# EAGLE design main (EAGLE 9.0.0)
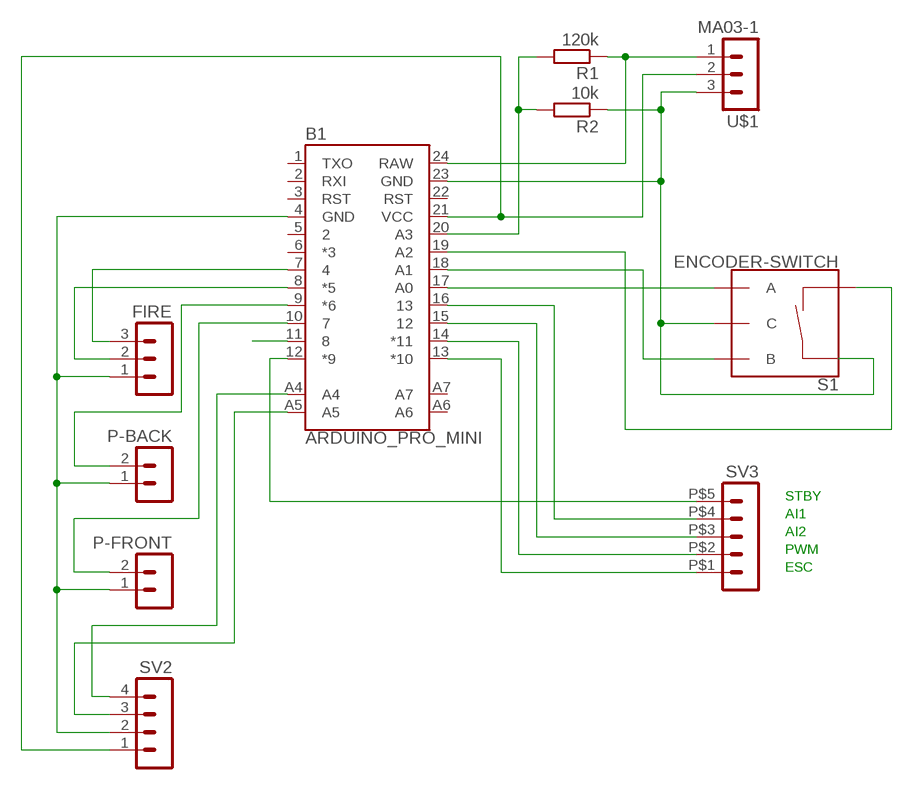
[diagram p0: schematic, sheet 1]

## Parts
B1  ARDUINO_PRO_MINI  [ARDUINO_PRO_MINI_WO]
FIRE  MA03-1  [MA03-1]
P-BACK  MA02-1  [MA02-1]
P-FRONT  MA02-1  [MA02-1]
R1  120k  R-EU_0204/5  [0204/5]
R2  10k  R-EU_0204/2V  [0204V]
S1  ENCODER-SWITCH  [ROTARY_ENC_PLAIN]
SV2  MA04-1  [MA04-1]
SV3  MA05-1  [MA05-1]
U$1  MA03-1  [MA03-1]

## Nets
N$1: B1.24(RAW) R1.1 U$1.1
N$2: B1.12(*9) SV3.P$5
N$3: B1.7 FIRE.3
N$4: B1.4(GND) FIRE.1 P-BACK.1 P-FRONT.1 SV2.2
N$5: B1.8(*5) FIRE.2
N$6: B1.11
N$7: B1.18(A1) S1.B
N$8: B1.9(*6) P-BACK.2
N$9: B1.10 P-FRONT.2
N$10: B1.17(A0) S1.A
N$11: B1.19(A2) S1.SW-
N$12: B1.23(GND) R2.1 S1.C U$1.3
N$13: B1.20(A3) R1.2 R2.2
N$15: B1.A4 SV2.4
N$16: B1.A5 SV2.3
N$17: B1.16 SV3.P$4
N$18: B1.15 SV3.P$3
N$19: B1.14(*11) SV3.P$2
N$20: B1.13(*10) SV3.P$1
N$23: B1.21(VCC) SV2.1 U$1.2
Unconnected: B1.1(TXO) B1.2(RXI) B1.3(RST) B1.5 B1.6(*3) B1.22(RST) B1.A6 B1.A7 S1.SW+

## Notes on the sheet
- STBY
- AI1
- AI2
- PWM
- ESC

## Library data of the parts
B1 = SparkFun-Boards:ARDUINO_PRO_MINI: SparkFun Pro Mini Pro Mini compatible footprint. Dimensions: 0.7 x 1.3" PCB Thickness: 0.8mm SparkFun Products: 3.3V/8MHz <https://www.sparkfun.com/products/11114> 5V/16MHz <https://www.sparkfun.com/products/11113>
FIRE U$1 = con-lstb:MA03-1
P-BACK P-FRONT = con-lstb:MA02-1
R1 R2 = rcl:R-EU_: RESISTOR, European symbol
S1 = SparkFun-Switches:ENCODER-SWITCH: Rotary Encoder w/ Select Switch Encoders rotate similarly to potentiometers, but they’re different from potentiometers in that an encoder has full rotation without limits. They output gray code so that you can tell how much and in which direction the encoder has been turned. This encoder includes a push-down select switch built into the shaft. SparkFun Products Rotary Encoder <https://www.sparkfun.com/products/9117> (COM-09117); SF_SKU: COM-09117
SV2 = con-lstb:MA04-1: PIN HEADER; OC_FARNELL: unknown; OC_NEWARK: unknown
SV3 = con-lstb:MA05-1: PIN HEADER; OC_FARNELL: unknown; OC_NEWARK: unknown

## Net classes
0 default: clearance 0.205 mm

## Board
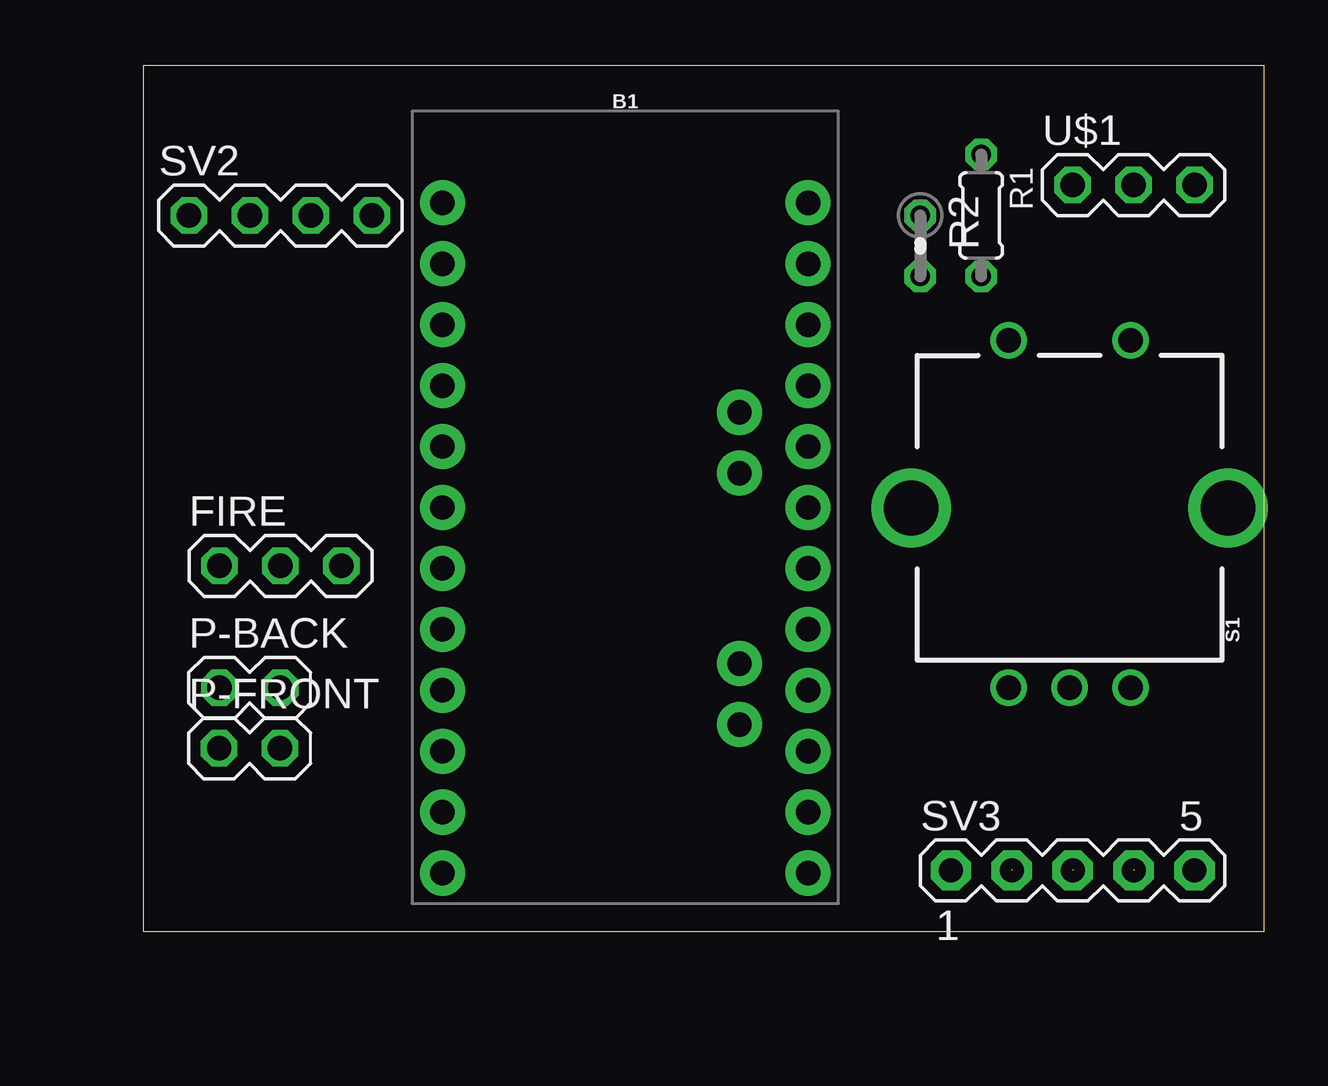
[diagram p1: board, top side]
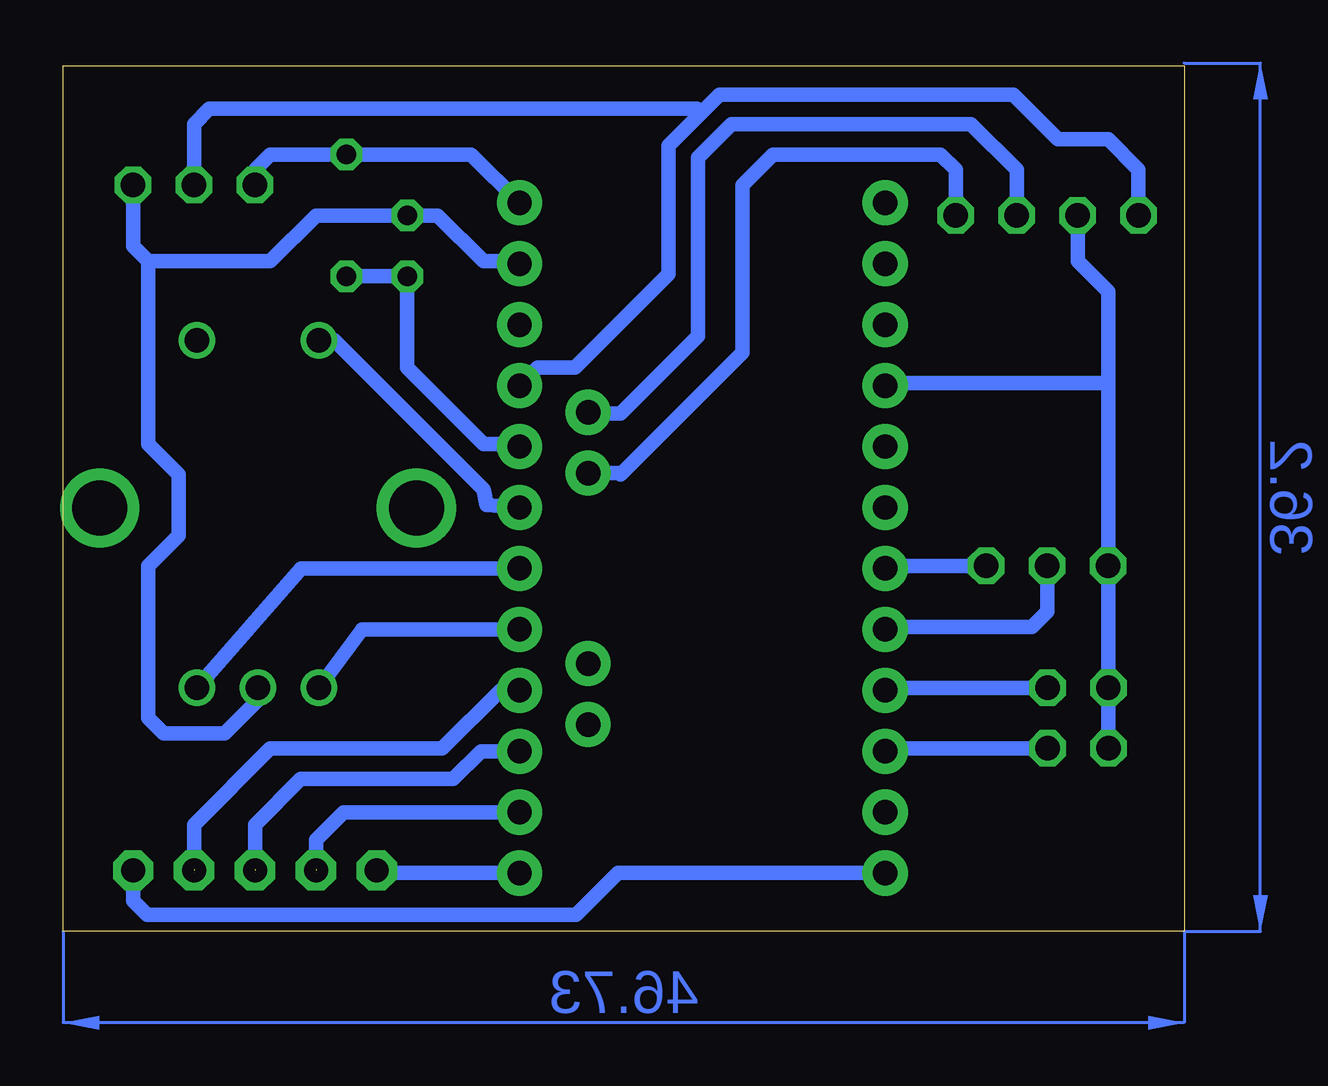
[diagram p2: board, bottom side, seen from below]

Size 46.73 x 36.09 mm. Coordinates in mm from the lower left corner, seen from the top.
Outline: 0,0 46.73,0 46.73,36.09 0,36.09 0,0
Copper layers (1*16): Top 0.035mm / dielectric 1.5mm / Bottom 0.035mm
Design rules "default *": minimum track width 6mil, minimum drill 0.35mm, track to track 24mil, track to pad 12mil, pad to pad 6mil, via to via 6mil, smd to smd 6mil, copper to edge 40mil, drill to drill 6mil, minimum pad ring 10mil, minimum via ring 8mil, stop-mask expansion 4mil, vias tented up to drill 0mil, thermal gap 10mil

### Footprints (pad centres in the part's own frame; a part is rotated, then mirrored left to right if it is on the bottom)
ARDUINO_PRO_MINI_WO = drill 1.016 pad 1.88: 1 -7.62,12.7; 2 -7.62,10.16; 3 -7.62,7.62; 4 -7.62,5.08; 5 -7.62,2.54; 6 -7.62,0; 7 -7.62,-2.54; 8 -7.62,-5.08; 9 -7.62,-7.62; 10 -7.62,-10.16; 11 -7.62,-12.7; 12 -7.62,-15.24; 13 7.62,-15.24; 14 7.62,-12.7; 15 7.62,-10.16; 16 7.62,-7.62; 17 7.62,-5.08; 18 7.62,-2.54; 19 7.62,0; 20 7.62,2.54; 21 7.62,5.08; 22 7.62,7.62; 23 7.62,10.16; 24 7.62,12.7; A4 4.763,1.429; A5 4.763,3.969; A6 4.763,-9.049; A7 4.763,-6.509
MA03-1 = drill 1.016 octagon: 1 -2.54,0; 2 0,0; 3 2.54,0
MA02-1 = drill 1.016 octagon: 1 0,0; 2 2.54,0
0204/5 = drill 0.813 octagon: 1 -2.54,0; 2 2.54,0
0204V = drill 0.813 octagon: 1 -1.27,0; 2 1.27,0
ROTARY_ENC_PLAIN = drill 1.016: A 7.493,-2.54; B 7.493,2.54; C 7.493,0; SW+ -6.985,2.54; SW- -6.985,-2.54 | drill 2.286: P$3 0,6.604; P$4 0,-6.604
MA04-1 = drill 1.016 octagon: 1 -3.81,0; 2 -1.27,0; 3 1.27,0; 4 3.81,0
MA05-1 = drill 1 pad 1.676 octagon: P$1 -5.08,0; P$2 -2.54,0; P$3 0,0; P$4 2.54,0; P$5 5.08,0

### Placement (x,y rotation side)
B1  20.09,17.67 0 top
FIRE  5.71,15.24 0 top
P-BACK  3.16,10.16 0 top
P-FRONT  3.16,7.63 0 top
R1  34.92,29.84 270 top
R2  32.38,28.57 270 top
S1  38.61,17.65 270 top
SV2  5.71,29.84 0 top
SV3  38.73,2.54 0 top
U$1  41.27,31.11 0 top

### Tracks (layer width: path | path; a pad name or v marks a point on that pad's centre or on a via)
N$1
  Bottom 0.61: B1.24 29.72,32.38 R1.1 38.1,32.38 38.73,31.75 U$1.1
N$2
  Bottom 0.61: B1.12 23.61,2.43 25.35,0.69 43.23,0.69 43.81,1.27 SV3.P$5
N$3
  Bottom 0.61: B1.7 12.36,15.24 FIRE.3
N$4
  Bottom 0.61: B1.4 12.36,22.86 3.17,22.86 | 3.17,22.86 3.17,17.15 | FIRE.1 3.17,17.15 | 3.17,17.15 P-BACK.1 3.16,13.98 P-FRONT.1 | SV2.2 4.45,27.94 3.17,26.67 3.17,22.86
N$5
  Bottom 0.61: B1.8 12.36,12.7 6.35,12.7 5.71,13.34 FIRE.2
N$7
  Bottom 0.61: S1.B 36.81,15.13 B1.18
N$8
  Bottom 0.61: B1.9 12.36,10.15 P-BACK.2
N$9
  Bottom 0.61: B1.10 12.35,7.63 P-FRONT.2
N$10
  Bottom 0.61: S1.A 34.27,12.59 B1.17
N$11
  Bottom 0.61: B1.19 29.09,17.78 29.21,18.41 35.43,24.64 S1.SW-
N$12
  Bottom 0.61: B1.23 27.82,27.94 29.21,27.94 31.11,29.84 R2.1 36.2,29.84 38.1,27.94 43.18,27.94 | 43.18,27.94 43.81,28.57 U$1.3 | 43.18,27.94 43.18,20.32 41.91,19.05 41.91,16.51 43.18,15.24 43.18,8.89 42.55,8.26 40.01,8.26 38.61,9.65 S1.C
N$13
  Bottom 0.61: B1.20 27.82,20.32 29.21,20.32 32.38,23.5 R2.2 R1.2
N$15
  Bottom 0.61: B1.A4 23.54,19.1 23.5,19.05 18.41,24.13 18.41,31.11 17.14,32.38 10.16,32.38 9.53,31.75 SV2.4
N$16
  Bottom 0.61: B1.A5 24.8,21.59 23.5,21.59 20.27,24.82 20.27,32.26 18.87,33.66 8.89,33.66 6.99,31.75 SV2.3
N$17  (1 unrouted)
  Bottom 0.61: B1.16 28.5,10.05 30.93,7.62 38.1,7.62 41.27,4.45 41.27,2.59
N$18  (1 unrouted)
  Bottom 0.61: B1.15 29.32,7.51 30.48,6.35 36.83,6.35 38.73,4.45 38.73,2.59
N$19  (1 unrouted)
  Bottom 0.61: B1.14 35.03,4.97 36.2,3.81 36.2,2.59
N$20
  Bottom 0.61: B1.13 32.91,2.43 33.02,2.54 SV3.P$1
N$23
  Bottom 0.61: B1.21 26.96,23.5 25.4,23.5 21.49,27.41 21.49,32.76 20.14,34.11 | 20.14,34.11 19.37,34.87 7.12,34.87 5.26,33.02 3.17,33.02 1.91,31.75 SV2.1 | 20.14,34.11 20.32,34.29 40.64,34.29 41.27,33.66 U$1.2
(copper drawn outside any net)
  shapes: Bottom area x2